# Altium schematic sheet Copy of PP_2_0_1.SchDoc
size 209 x 297 mm; PageSetup: Record=PageOptions|CenterHorizontal=True|CenterVertical=True|PrintScale=0.94|XCorrection=1.00|YCorrection=1.00|PrintKind=2|BorderSize=5000000|LeftOffset=0|BottomOffset=0|Orientation=1|PaperLength=2970|PaperWidth=2100|Scale=100|PaperSource=7|PrintQuality=600|MediaType=1|DitherType=10|PaperKind=A4|PrintScaleMode=1; Title1str: (вторая строка при необходимости); DocumentType: Тип схемы; DocumentNumber: 53251498.468331.01.04.00 Э3; SheetNumber: 2; Format: A4
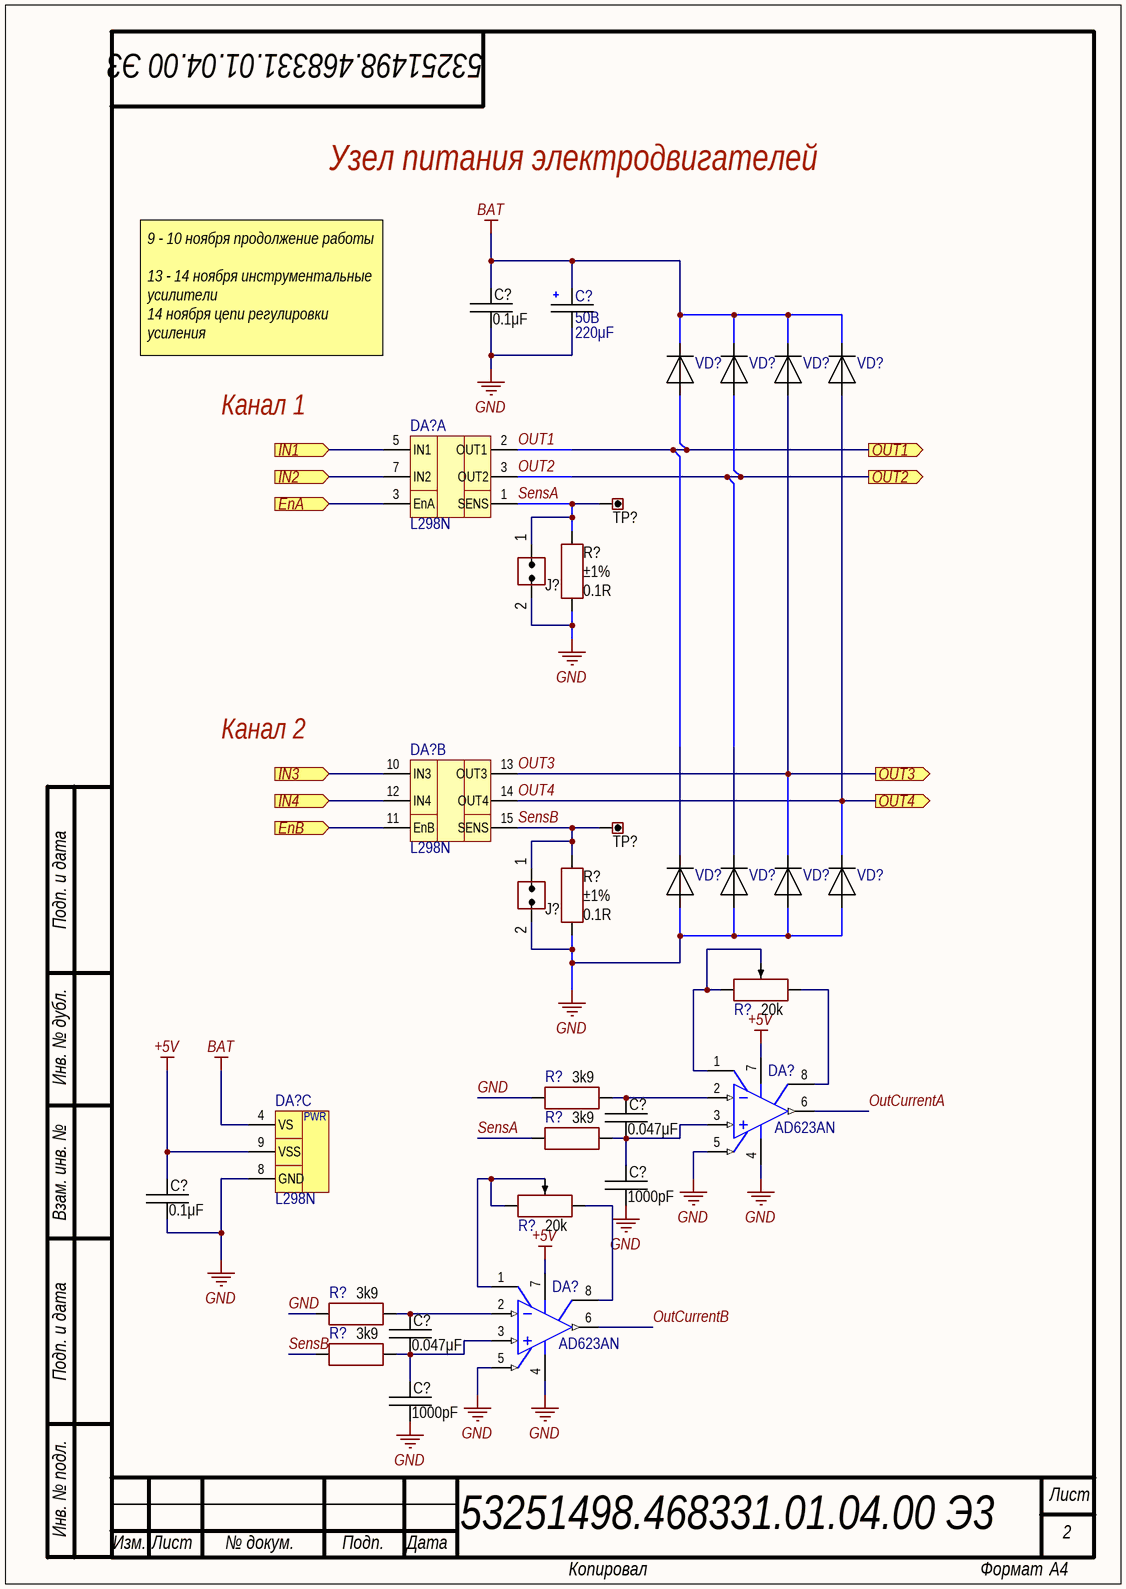
[diagram p0: Copy of PP_2_0_1.SchDoc]

## Parts
(Parts that share a designator on the sheet are numbered #1, #2 ... from top to bottom, then left to right.)
C?#1  value 0.1μF  [CAP: 0805, Thru-Hole]
C?#2  value 220μF  Voltage: 50В  [CAP: RB2-5]  (hidden comment: Cap Pol1)
C?#3  value 0.047μF  [CAP: 0805, Thru-Hole]
C?#4  value 1000pF  [CAP: 0805, Thru-Hole]
C?#5  value 0.1μF  [CAP: 0805, Thru-Hole]
C?#6  value 0.047μF  [CAP: 0805, Thru-Hole]
C?#7  value 1000pF  [CAP: 0805, Thru-Hole]
DA?#1  L298N  [Multivatt15]  (part A of 3)
DA?#2  L298N  [Multivatt15]  (part B of 3)
DA?#3  AD623AN  [DIP-8]
DA?#4  L298N  [Multivatt15]  (part C of 3)
DA?#5  AD623AN  [DIP-8]
J?#1  (no value)  [CON: PLS-2]
J?#2  (no value)  [CON: PLS-2]
R?#1  value 0.1R  Tolerance: ±1%  [RES:CF-1/1W]
R?#2  value 0.1R  Tolerance: ±1%  [RES:CF-1/1W]
R?#3  value 20k  [RES: 3296W]
R?#4  value 3k9  [RES:CF-1/4W]
R?#5  value 3k9  [RES:CF-1/4W]
R?#6  value 20k  [RES: 3296W]
R?#7  value 3k9  [RES:CF-1/4W]
R?#8  value 3k9  [RES:CF-1/4W]
TP?#1  (no value)  [CON: 5000 (Keystone)]
TP?#2  (no value)  [CON: 5000 (Keystone)]
VD?#1  (no value)  [DIODE: DO-41]
VD?#2  (no value)  [DIODE: DO-41]
VD?#3  (no value)  [DIODE: DO-41]
VD?#4  (no value)  [DIODE: DO-41]
VD?#5  (no value)  [DIODE: DO-41]
VD?#6  (no value)  [DIODE: DO-41]
VD?#7  (no value)  [DIODE: DO-41]
VD?#8  (no value)  [DIODE: DO-41]

## Ports
EnA (in), EnB (in), IN1 (in), IN2 (in), IN3 (in), IN4 (in), OUT1 (out), OUT2 (out), OUT3 (out), OUT4 (out)

## Nets
+5V: C?#5.2 DA?#3.7(V+) DA?#4.9(VSS) DA?#5.7(V+)
BAT: C?#1.2 C?#2.2 DA?#4.4(VS) VD?#1.2 VD?#2.2 VD?#3.2 VD?#4.2
GND: C?#1.1 C?#2.1 C?#4.1 C?#5.1 C?#7.1 DA?#3.4(V-) DA?#3.5(REF) DA?#4.8(GND) DA?#5.4(V-) DA?#5.5(REF) J?#1.2(IN) J?#2.2(IN) R?#1.1 R?#2.1 R?#4.1 R?#7.1 VD?#5.1 VD?#6.1 VD?#7.1 VD?#8.1
EnA: DA?#1.3(EnA) ; port EnA
EnB: DA?#2.11(EnB) ; port EnB
IN1: DA?#1.5(IN1) ; port IN1
IN2: DA?#1.7(IN2) ; port IN2
IN3: DA?#2.10(IN3) ; port IN3
IN4: DA?#2.12(IN4) ; port IN4
OUT1: DA?#1.2(OUT1) VD?#1.1 VD?#5.2 ; port OUT1
OUT2: DA?#1.3(OUT2) VD?#2.1 VD?#6.2 ; port OUT2
OUT3: DA?#2.13(OUT3) VD?#3.1 VD?#7.2 ; port OUT3
OUT4: DA?#2.14(OUT4) VD?#4.1 VD?#8.2 ; port OUT4
OutCurrentA: DA?#3.6(OUT)
OutCurrentB: DA?#5.6(OUT)
SensA: DA?#1.1(SENS) J?#1.1(IN) R?#1.2 R?#5.1 TP?#1.1
SensB: DA?#2.15(SENS) J?#2.1(IN) R?#2.2 R?#8.1 TP?#2.1
NetC?#3_1: C?#3.1 C?#4.2 DA?#3.3(+IN) R?#5.2
NetC?#3_2: C?#3.2 DA?#3.2(-IN) R?#4.2
NetC?#6_1: C?#6.1 C?#7.2 DA?#5.3(+IN) R?#8.2
NetC?#6_2: C?#6.2 DA?#5.2(-IN) R?#7.2
NetDA?#3_1: DA?#3.1(RG) R?#3.1 R?#3.2
NetDA?#3_8: DA?#3.8(RG) R?#3.3
NetDA?#5_1: DA?#5.1(RG) R?#6.1 R?#6.2
NetDA?#5_8: DA?#5.8(RG) R?#6.3

## Notes on the sheet
- Узел питания электродвигателей
- 9 - 10 ноября продолжение работы
  13 - 14 ноября инструментальные усилители
  14 ноября цепи регулировки усиления
- Канал 1
- Канал 2
- Подп. и дата
- Инв. № дубл.
- Взам. инв. №
- Инв. № подл.
- Лист
- Изм.
- № докум.
- Подп.
- Дата
- Копировал
- Формат
- (in symbol L298N, part C) PWR

## Library data of the parts
C?#1 C?#5 = Ceramic_0805: К10-17 0805; Manufacturer: Murata; PartNumber: RPEE41H105M3M1C05A; ValueManufacturerPartNumber: Ceramic capacitor, 0.1μF, X7R, ±10%, 50V, 1206, -55...+125°C; TypeCapacitor: Ceramic capacitor; Tolerance: ±10%; TypeDielectric: X7R; Voltage: 50V; Package: 1206; HelpURL: https://www.chipdip.ru/product/rpee41h105m3; Temperature: -55...+125°C
C?#2 = Cap Pol1: ECAP (К50-35), 220мкФ, 50В, 105°C, 20%, 10x12мм P:5мм; Partnumber: JRB1H221M05001000120000B; Pitch: 5mm; Published: 8-Jun-2000; LatestRevisionDate: 17-Jul-2002; LatestRevisionNote: Re-released for DXP Platform.; PackageReference: RB5-10; Publisher: Altium Limited; PackageDescription: Polarized Capacitor (Radial); 2 Leads
C?#3 C?#6 = Ceramic_0805: К10-17Б имп. 0.047мкФ X7R,10%,0805, Конденсатор керамический выводной; Manufacturer: Murata; PartNumber: CERCAP0.047/50V0805KX7R; ValueManufacturerPartNumber: Ceramic capacitor, 0.047μF, X7R, ±10%, 50V, 0805, -55...+125°C; TypeCapacitor: Ceramic capacitor; Voltage: 50V; Package: 0805; HelpURL: https://www.chipdip.ru/product0/299614683; Temperature: -55...+125°C; Tolerance: ±10%; TypeDielectric: X7R
C?#4 C?#7 = Ceramic_0805: К10-17Б имп. 1000пФ X7R,10%,0805, Конденсатор керамический выводной; Manufacturer: Murata; PartNumber: RPEE41H105M3M1C05A; ValueManufacturerPartNumber: Ceramic capacitor, 1000pF, X7R, ±10%, 50V, 0805, -55...+125°C; TypeCapacitor: Ceramic capacitor; Voltage: 50V; Package: 0805; HelpURL: https://www.chipdip.ru/product/rpee41h105m3; Temperature: -55...+125°C; Tolerance: ±10%; TypeDielectric: X7R
DA?#1 DA?#2 DA?#4 = L298N: L298N, Двойной полномостовой драйвер [Multiwatt-15, Vertical]
DA?#3 DA?#5 = AD623AN: Low-Cost Instrumentation Amplifier; Published: 8-Jun-2000; LatestRevisionDate: 04-Mar-2005; LatestRevisionNote: Stylized 3D Model Added.; DatasheetVersion: REV.A 1997; PackageReference: N-8_A; Publisher: Altium Limited; PackageDescription: DIP; 8 Leads; Row Spacing 7.62 mm; Pitch 2.54 mm; Code_JEDEC: MO-001-AN; ComponentLink1Description: Manufacturer Link; ComponentLink1URL: http://www.analog.com/en/prod/0%2C2877%2CAD622%2C00.html; ComponentLink2Description: Datasheet; ComponentLink2URL: http://www.analog.com/UploadedFiles/Data_Sheets/218546992AD622_c.pdf
J?#1 J?#2 = Jumper_single: CommentText: "Перемычка"
R?#1 R?#2 = Resistor_CF-100: KNP-100 1 Вт, 0.1 Ом, 5%, Резистор проволочный; Manufacturer: Yageo; PartNumber: KNP-1W-0R1J; ValueManufacturerPartNumber: Resistor film, 0.1R, ±1%, CF-100, 1W, -55...+125°C; TypeResistor: Resistor film; Power: 1W; Package: CF-100; HelpURL: https://www.digikey.com/product-detail/en/yageo/RC0201JR-07100RL/311-100NCT-ND/1949006; Temperature: -55...+125°C
R?#3 R?#6 = Trimmer: 3296W-1-203LF (СП5-2ВБ), 20 кОм, Резистор подстроечный; Manufacturer: Bourns; ValueManufacturerPartNumber: Resistor film, 20k, ±10%, 3296W, 0.5W, -55...+125°C; TypeResistor: Resistor film; Power: 0.5W; Tolerance: ±10%; PartNumber: 3296W-1-203LF; Package: 3296W; HelpURL: https://www.digikey.com/product-detail/en/bourns-inc/3296W-1-103LF/3296W-103LF-ND/1088045; Temperature: -55...+125°C
R?#4 R?#5 R?#7 R?#8 = Resistor_CF-25: MF-25 (С2-23) 0.25 Вт, 3.9 кОм, 1%, Резистор металлопленочный; Manufacturer: Yageo; PartNumber: MF-1/4W-3K9F; ValueManufacturerPartNumber: Resistor film, 3k9, ±1%, CF-25, 0.25W, -55...+125°C; TypeResistor: Resistor film; Power: 0.25W; Package: CF-25; HelpURL: https://www.chipdip.ru/product0/57331; Temperature: -55...+125°C; Tolerance: ±1%
TP?#1 TP?#2 = Connector_Test_Point: Manufacturer: Keystone; ValueManufacturerPartNumber: Test point, Keystone, 5001; PartNumber: 5001; TypeConnector: Test point; HelpURL: https://www.digikey.com/product-detail/en/keystone-electronics/5001/36-5001-ND/255327
VD?#1-VD?#8 = 1N4007: Manufacturer: Micro Commercial; ValueManufacturerPartNumber: Single diode, 1000V, 1A, 1V, 4ns, DO-41, -55...+150°C; TypeDiode: Single diode; Voltage: 1000V; Current: 1A; VoltageDrop: 1V; RecoveryTime: 4ns; Package: DO-41; HelpURL: https://www.chipdip.ru/product/1n4007; Temperature: -55...+150°C; PartNumber: 1N4007